# EAGLE design switchBoardMWS-v1 (EAGLE 9.6.2)
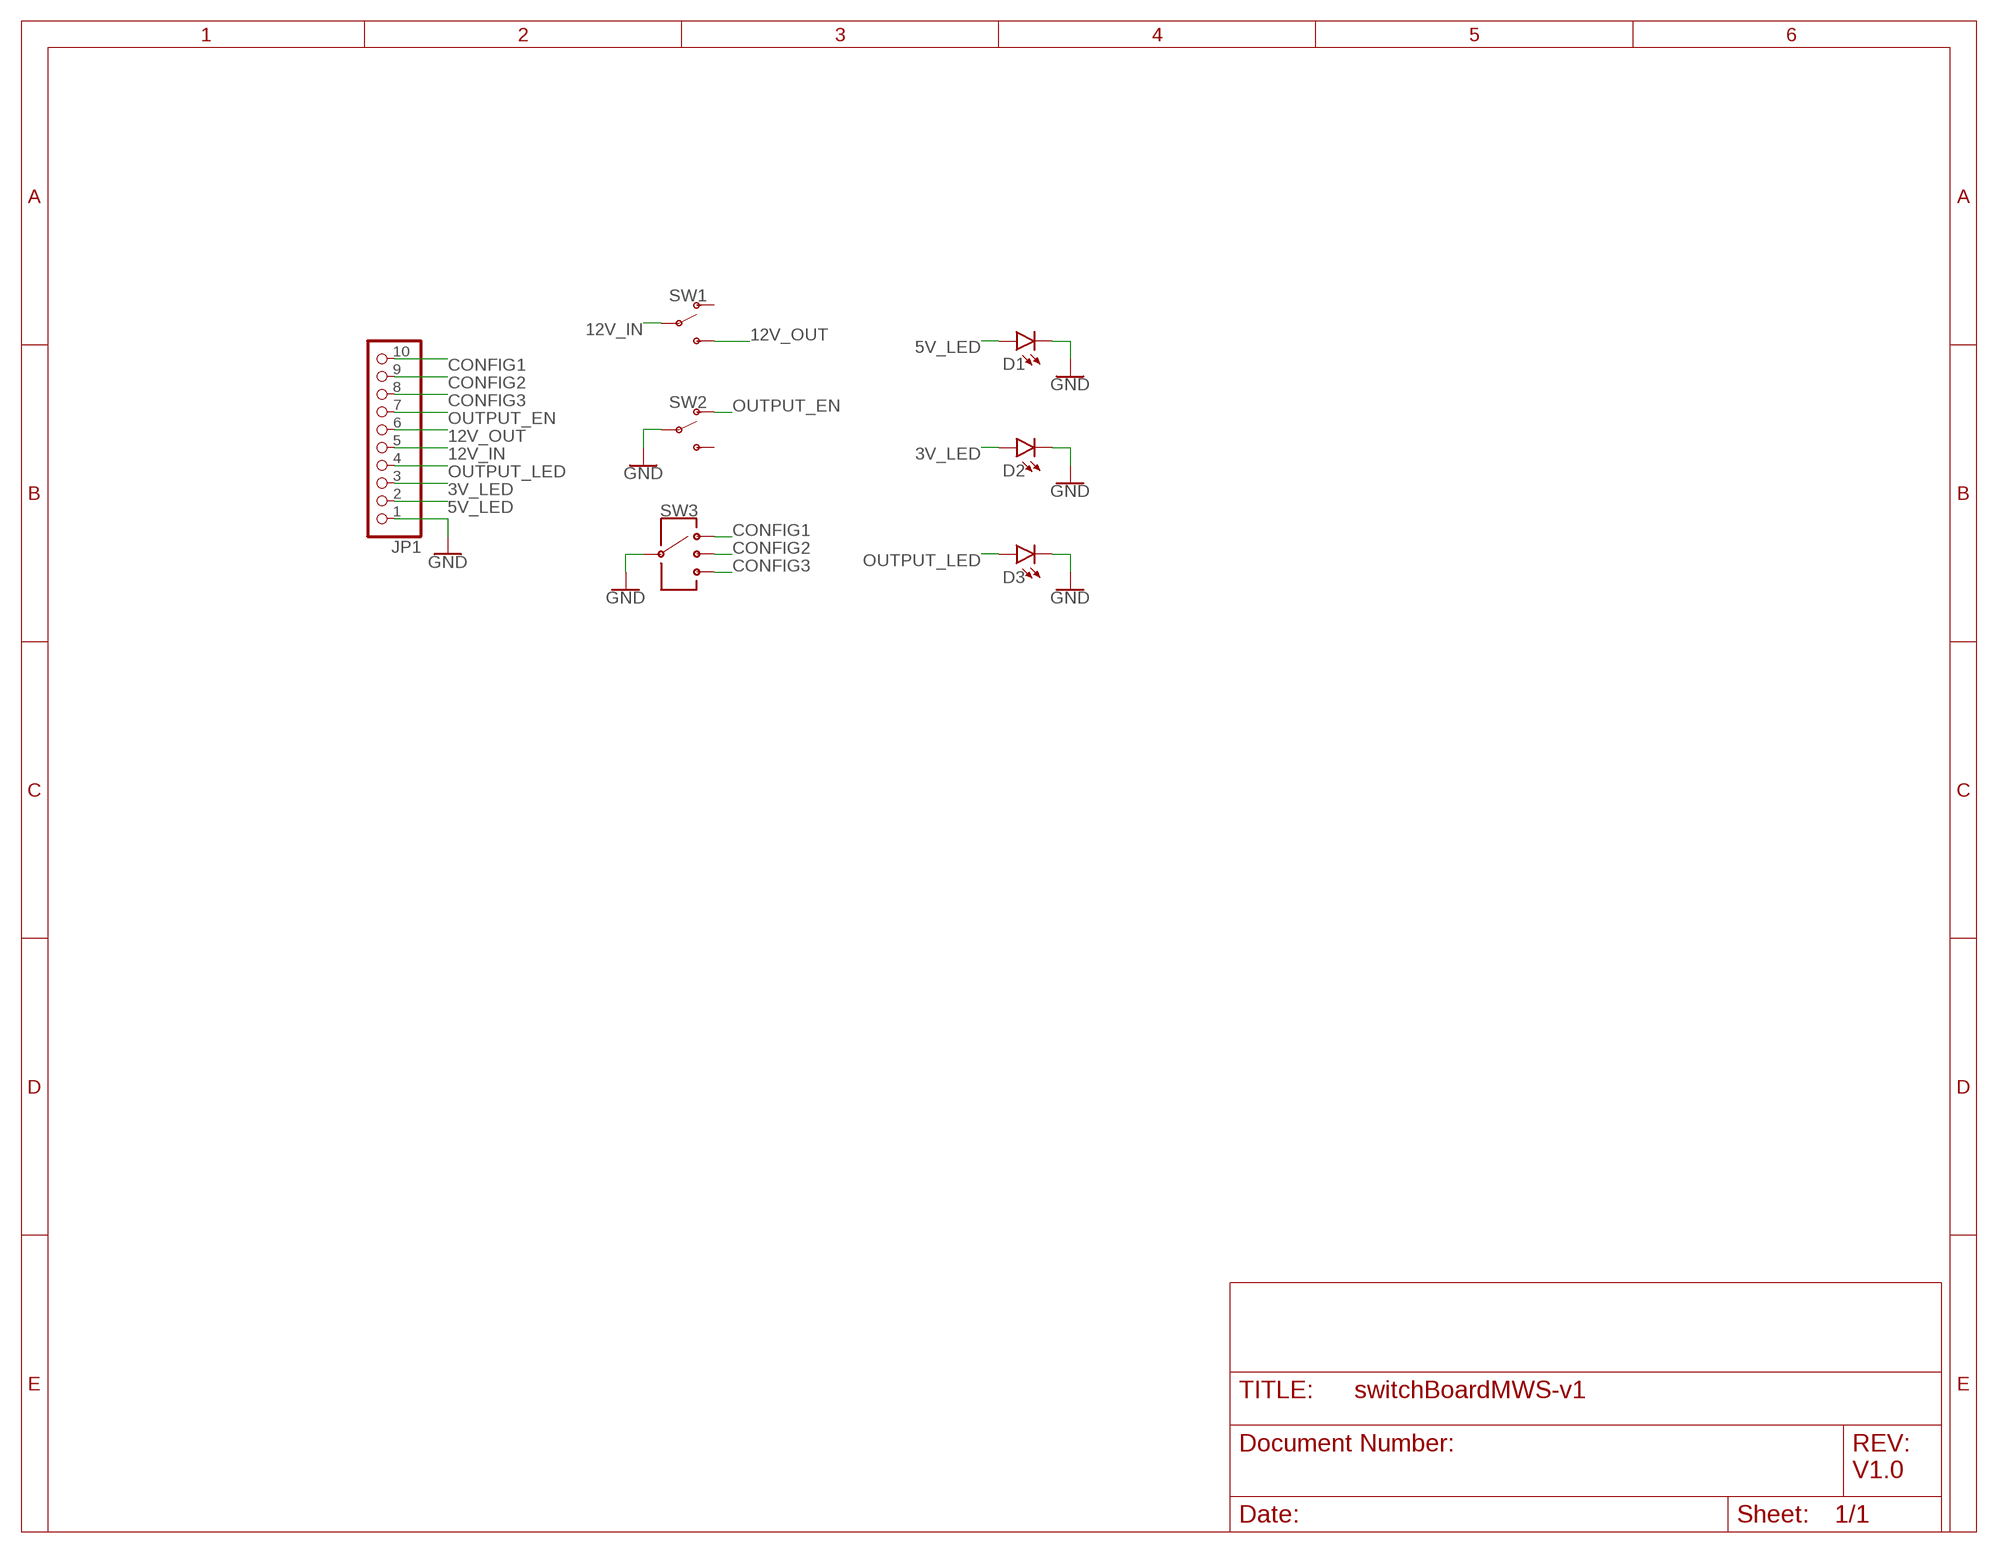
[diagram p0: schematic, sheet 1]

## Parts
D1  LED5MM  [LED_5MM]
D2  LED5MM  [LED_5MM]
D3  LED5MM  [LED_5MM]
JP1  PINHD-1X10  [1X10]
SW1  SPDT  [SPDT]
SW2  SPDT  [SPDT]
SW3  SP3T  [SP3T]

## Nets
3V_LED: D2.A JP1.3
5V_LED: D1.A JP1.2
12V_IN: JP1.5 SW1.2(P)
12V_OUT: JP1.6 SW1.3(S)
CONFIG1: JP1.10 SW3.P$1
CONFIG2: JP1.9 SW3.P$3
CONFIG3: JP1.8 SW3.P$4
GND: D1.K(C) D2.K(C) D3.K(C) JP1.1 SW2.2(P) SW3.P$2
OUTPUT_EN: JP1.7 SW2.1(O)
OUTPUT_LED: D3.A JP1.4
Unconnected: SW1.1(O) SW2.3(S)

## Notes on the sheet
- V1.0

## Library data of the parts
D1-D3 = SparkFun-LED:LED: LED (Generic) Standard schematic elements and footprints for 5mm, 3mm, 1206, and 0603 sized LEDs. Generic LEDs with no color specified.
JP1 = pinhead:PINHD-1X10: PIN HEADER
SW1 SW2 = ece445:SPDT
SW3 = ece445:SP3T

## Board
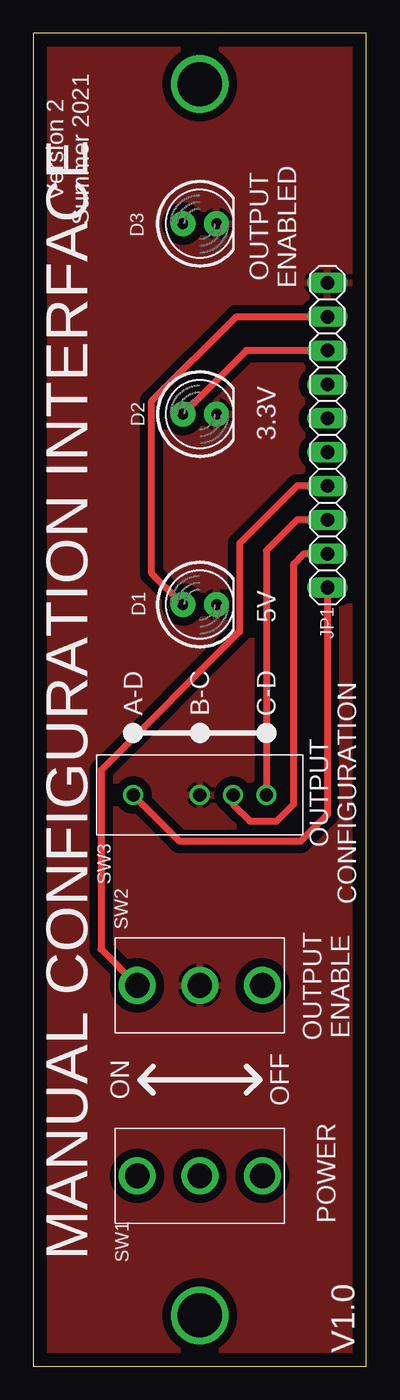
[diagram p1: board, top side]
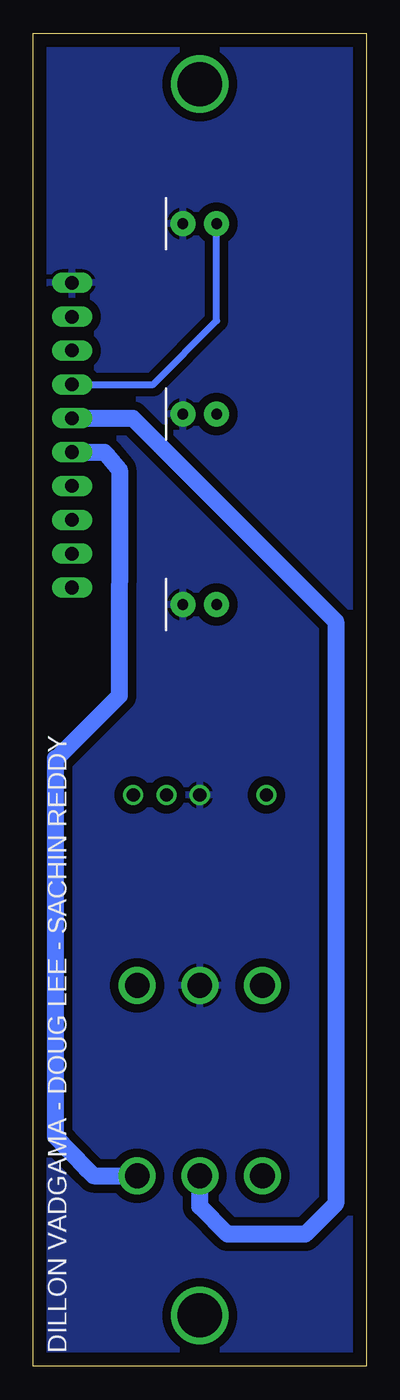
[diagram p2: board, bottom side, seen from below]

Size 25 x 100 mm. Coordinates in mm from the lower left corner, seen from the top.
Outline: 0,0 25,0 25,100 0,100 0,0
Copper layers (1*16): Top 0.035mm / dielectric 1.5mm / Bottom 0.035mm
Design rules "default": minimum track width 6mil, minimum drill 0.35mm, track to track 6mil, track to pad 6mil, pad to pad 6mil, via to via 6mil, smd to smd 6mil, copper to edge 40mil, drill to drill 6mil, minimum pad ring 10mil, minimum via ring 8mil, stop-mask expansion 4mil, vias tented up to drill 0mil, thermal gap 10mil

### Footprints (pad centres in the part's own frame; a part is rotated, then mirrored left to right if it is on the bottom)
LED_5MM = drill 0.813 pad 1.88: A -1.27,0; K 1.27,0
1X10 = drill 1.016 long: 1 -11.43,0; 2 -8.89,0; 3 -6.35,0; 4 -3.81,0; 5 -1.27,0; 6 1.27,0; 7 3.81,0; 8 6.35,0; 9 8.89,0; 10 11.43,0
SPDT = drill 1.85: 1 -4.7,0; 2 0,0; 3 4.7,0
SP3T = drill 1: P$1 0,0; P$2 5,0; P$3 7.5,0; P$4 10,0

### Placement (x,y rotation side)
D1  12.5,57.14 0 top
D2  12.5,71.43 0 top
D3  12.5,85.71 0 top
JP1  22.09,69.85 270 top
SW1  12.5,14.29 0 top
SW2  12.5,28.57 0 top
SW3  7.5,42.86 0 top

### Tracks (layer width: path | path; a pad name or v marks a point on that pad's centre or on a via)
3V_LED
  Top 0.508: JP1.3 16,76.2 D2.A
5V_LED
  Top 0.508: D1.A 8.89,59.48 8.89,72.39 15.24,78.74 JP1.2
12V_IN
  Bottom 1.27: JP1.5 17.53,71.12 2.29,55.88 2.29,12.19 4.57,9.91 10.41,9.91 12.5,11.99 SW1.2
12V_OUT
  Bottom 1.27: JP1.6 19.68,68.58 19.5,68.4 18.52,67.24 18.54,50.3 23.24,45.6 23.35,45.6 23.35,17.23 21,14.8 20.49,14.29 SW1.3
CONFIG1
  Top 0.508: JP1.10 22.09,41.39 20.07,39.37 10.99,39.37 SW3.P$1
CONFIG2
  Top 0.508: SW3.P$3 15,42.15 16.26,40.89 18.29,40.89 19.56,42.16 19.56,60.2 20.32,60.96 JP1.9
CONFIG3
  Top 0.508: JP1.8 19.81,63.5 17.5,61.19 SW3.P$4
GND
  pour Top (isolate 0.635): -0.51,100.58 25.65,100.58 25.65,-0.51 -0.51,-0.51
  pour Bottom (isolate 0.635): -1.02,101.09 1.02,101.09 26.16,101.09 26.16,100.58 26.16,-1.02 24.89,-1.02 -1.02,-1.02 -1.02,0.25
N$1  (via drill 3.3)
  other vias: 12.5,3.81
N$2  (via drill 3.3)
  other vias: 12.5,96.19
OUTPUT_EN
  Top 0.508: JP1.7 19.81,66.04 15.49,61.72 15.49,55.12 5.08,44.7 5.08,31.29 SW2.1
OUTPUT_LED
  Bottom 0.508: JP1.4 16,73.66 11.23,78.43 D3.A

### Text on the board
tNames: Version 2 / Summer 2021 | OUTPUT / ENABLED | 3.3V | 5V | MANUAL CONFIGURATION INTERFACE | A-D | B-C | C-D | OUTPUT / CONFIGURATION | OUTPUT / ENABLE | ON | OFF | POWER | V1.0
bNames: DILLON VADGAMA - DOUG LEE - SACHIN REDDY